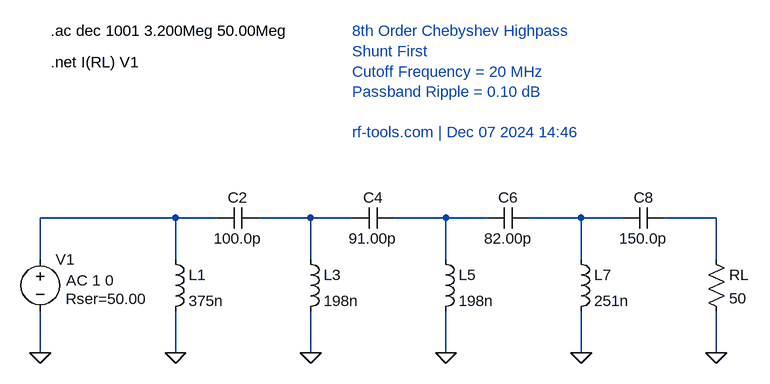
[diagram p0: schematic 15m_hpf.asc]
15m_hpf.asc, the LTspice schematic file:
Version 4
SHEET 1 1200 400
WIRE 208 0 0 0
WIRE 272 0 208 0
WIRE 416 0 336 0
WIRE 480 0 416 0
WIRE 624 0 544 0
WIRE 688 0 624 0
WIRE 832 0 752 0
WIRE 896 0 832 0
WIRE 1040 0 960 0
WIRE 0 64 0 0
WIRE 208 64 208 0
WIRE 416 64 416 0
WIRE 624 64 624 0
WIRE 832 64 832 0
WIRE 1040 64 1040 0
WIRE 0 208 0 144
WIRE 208 208 208 144
WIRE 416 208 416 144
WIRE 624 208 624 144
WIRE 832 208 832 144
WIRE 1040 208 1040 144
FLAG 0 208 0
FLAG 208 208 0
FLAG 416 208 0
FLAG 624 208 0
FLAG 832 208 0
FLAG 1040 208 0
SYMBOL voltage 0 48 R0
WINDOW 123 40 48 Left 2
WINDOW 39 39 77 Left 2
SYMATTR Value2 AC 1 0
SYMATTR SpiceLine Rser=50.00
SYMATTR InstName V1
SYMATTR Value ""
SYMBOL ind 192 48 R0
SYMATTR InstName L1
SYMATTR Value 375n
SYMBOL cap 272 16 R270
WINDOW 0 32 32 VTop 2
WINDOW 3 0 32 VBottom 2
SYMATTR InstName C2
SYMATTR Value 100.0p
SYMBOL ind 400 48 R0
SYMATTR InstName L3
SYMATTR Value 198n
SYMBOL cap 480 16 R270
WINDOW 0 32 32 VTop 2
WINDOW 3 0 32 VBottom 2
SYMATTR InstName C4
SYMATTR Value 91.00p
SYMBOL ind 608 48 R0
SYMATTR InstName L5
SYMATTR Value 198n
SYMBOL cap 688 16 R270
WINDOW 0 32 32 VTop 2
WINDOW 3 0 32 VBottom 2
SYMATTR InstName C6
SYMATTR Value 82.00p
SYMBOL ind 816 48 R0
SYMATTR InstName L7
SYMATTR Value 251n
SYMBOL cap 896 16 R270
WINDOW 0 32 32 VTop 2
WINDOW 3 0 32 VBottom 2
SYMATTR InstName C8
SYMATTR Value 150.0p
SYMBOL res 1024 48 R0
SYMATTR InstName RL
SYMATTR Value 50
TEXT 16 -288 Left 2 !.ac dec 1001 3.200Meg 50.00Meg
TEXT 16 -240 Left 2 !.net I(RL) V1
TEXT 480 -288 Left 2 ;8th Order Chebyshev Highpass\nShunt First\nCutoff Frequency = 20 MHz\nPassband Ripple = 0.10 dB\n\nrf-tools.com | Dec 07 2024 14:46

The netlist it stands for:
* 15m_hpf.asc
V1 N001 0 AC 1 0 Rser=50.00
L1 N001 0 375n
C2 N001 N002 100.0p
L3 N002 0 198n
C4 N002 N003 91.00p
L5 N003 0 198n
C6 N003 N004 82.00p
L7 N004 0 251n
C8 N004 N005 150.0p
RL N005 0 50
.ac dec 1001 3.200Meg 50.00Meg
.net I(RL) V1
* 8th Order Chebyshev Highpass
* Shunt First
* Cutoff Frequency = 20 MHz
* Passband Ripple = 0.10 dB
* rf-tools.com | Dec 07 2024 14:46
.backanno
.end